# EAGLE design untitled (EAGLE 6.1)
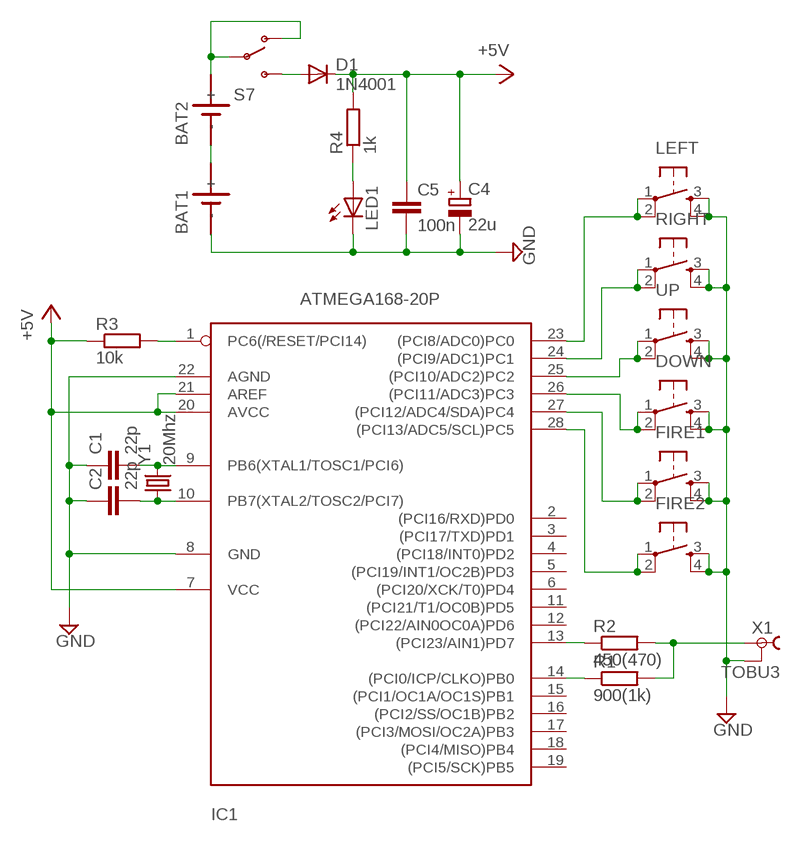
[diagram p0: schematic, sheet 1]

## Parts
BAT1  SN2032  [SN2032]
BAT2  SN2032  [SN2032]
C1  22p  C-EU025-025X050  [C025-025X050]
C2  22p  C-EU025-025X050  [C025-025X050]
C4  22u  CPOL-EUTT2D5L  [TT2D5L]
C5  100n  C-EU025-025X050  [C025-025X050]
D1  1N4001  DIODE-D-2.5  [D-2.5]
DOWN  TAC_SWITCHPTH  [TACTILE-PTH]
FIRE1  TAC_SWITCHPTH  [TACTILE-PTH]
FIRE2  TAC_SWITCHPTH  [TACTILE-PTH]
IC1  ATMEGA168-20P  [DIL28-3]
LED1  LED3MM  [LED3MM]
LEFT  TAC_SWITCHPTH  [TACTILE-PTH]
R1  900(1k)  R-EU_0207/2V  [0207/2V]
R2  450(470)  R-EU_0207/2V  [0207/2V]
R3  10k  R-EU_0207/10  [0207/10]
R4  1k  R-EU_0204/2V  [0204V]
RIGHT  TAC_SWITCHPTH  [TACTILE-PTH]
S7  SWITCH-SPSTPTH  [SWITCH-SPDT]
UP  TAC_SWITCHPTH  [TACTILE-PTH]
X1  TOBU3  [TOBU3]
Y1  20Mhz  CRYSTALHC49US  [HC49US]

## Nets
+5V: C4.+ C5.1 D1.C IC1.7(VCC) IC1.20(AVCC) IC1.21(AREF) R3.1 R4.2
GND: BAT1.- C1.1 C2.1 C4.- C5.2 DOWN.3 DOWN.4 FIRE1.3 FIRE1.4 FIRE2.3 FIRE2.4 IC1.8(GND) IC1.22(AGND) LED1.K(C) LEFT.3 LEFT.4 RIGHT.3 RIGHT.4 UP.3 UP.4 X1.2 X1.2@1 X1.2@2
N$1: C1.2 IC1.9(PB6(XTAL1/TOSC1/PCI6)) Y1.2
N$2: C2.2 IC1.10(PB7(XTAL2/TOSC2/PCI7)) Y1.1
N$3: BAT2.+ S7.1(O) S7.2(P)
N$4: IC1.23((PCI8/ADC0)PC0) LEFT.1 LEFT.2
N$5: LED1.A R4.1
N$6: IC1.25((PCI10/ADC2)PC2) UP.1 UP.2
N$7: IC1.1(PC6(/RESET/PCI14)) R3.2
N$8: FIRE2.1 FIRE2.2 IC1.28((PCI13/ADC5/SCL)PC5)
N$9: FIRE1.1 FIRE1.2 IC1.27((PCI12/ADC4/SDA)PC4)
N$10: DOWN.1 DOWN.2 IC1.26((PCI11/ADC3)PC3)
N$11: D1.A S7.3(S)
N$12: BAT1.+ BAT2.-
N$15: IC1.14((PCI0/ICP/CLKO)PB0) R1.1
N$16: IC1.13((PCI23/AIN1)PD7) R2.1
N$17: R1.2 R2.2 X1.1
RIGHT: IC1.24((PCI9/ADC1)PC1) RIGHT.1 RIGHT.2
Unconnected: IC1.2((PCI16/RXD)PD0) IC1.3((PCI17/TXD)PD1) IC1.4((PCI18/INT0)PD2) IC1.5((PCI19/INT1/OC2B)PD3) IC1.6((PCI20/XCK/T0)PD4) IC1.11((PCI21/T1/OC0B)PD5) IC1.12((PCI22/AIN0OC0A)PD6) IC1.15((PCI1/OC1A/OC1S)PB1) IC1.16((PCI2/SS/OC1B)PB2) IC1.17((PCI3/MOSI/OC2A)PB3) IC1.18((PCI4/MISO)PB4) IC1.19((PCI5/SCK)PB5)

## Library data of the parts
BAT1 BAT2 = sn2032:SN2032: LI BATTERY
C1 C2 C5 = rcl:C-EU: CAPACITOR, European symbol
C4 = rcl:CPOL-EU: POLARIZED CAPACITOR, European symbol
D1 = diode:DIODE-: DIODE
DOWN FIRE1 FIRE2 LEFT RIGHT UP = SparkFun-Electromechanical:TAC_SWITCH: Momentary Switch Button commonly used for reset or general input. Spark Fun Electronics SKU : COM-00097 SMT- SWCH-08247
IC1 = adafruit:ATMEGA168*P: MICROCONTROLLER 16 kBytes FLASH 1 kBytes SRAM 512 Bytes EEPROM USART 8-channel 10 bit ADC
LED1 = led:LED: LED OSRAM: - CHIPLED LG R971, LG N971, LY N971, LG Q971, LY Q971, LO R971, LY R971 LH N974, LH R974 LS Q976, LO Q976, LY Q976 LO Q996 - Hyper CHIPLED LW Q18S LB Q993, LB Q99A, LB R99A - SideLED LS A670, LO A670, LY A670, LG A670, LP A670 LB A673, LV A673, LT A673, LW A673 LH A674 LY A675 LS A676, LA A676, LO A676, LY A676, LW A676 LS A679, LY A679, LG A679 - Hyper Micro SIDELED® LS Y876, LA Y876, LO Y876, LY Y876 LT Y87S - SmartLED LW L88C, LW L88S LB L89C, LB L89S, LG L890 LS L89K, LO L89K, LY L89K LS L896, LA L896, LO L896, LY L896 - TOPLED LS T670, LO T670, LY T670, LG T670, LP T670 LSG T670, LSP T670, LSY T670, LOP T670, LYG T670 LG T671, LOG T671, LSG T671 LB T673, LV T673, LT T673, LW T673 LH T674 LS T676, LA T676, LO T676, LY T676, LB T676, LH T676, LSB T676, LW T676 LB T67C, LV T67C, LT T67C, LS T67K, LO T67K, LY T67K, LW E67C LS E67B, LA E67B, LO E67B, LY E67B, LB E67C, LV E67C, LT E67C LW T67C LS T679, LY T679, LG T679 LS T770, LO T770, LY T770, LG T770, LP T770 LB T773, LV T773, LT T773, LW T773 LH T774 LS E675, LA E675, LY E675, LS T675 LS T776, LA T776, LO T776, LY T776, LB T776 LHGB T686 LT T68C, LB T68C - Hyper Mini TOPLED® LB M676 - Mini TOPLED Santana® LG M470 LS M47K, LO M47K, LY M47K Source: http://www.osram.convergy.de LUXEON: - LUMILED® LXK2-PW12-R00, LXK2-PW12-S00, LXK2-PW14-U00, LXK2-PW14-V00 LXK2-PM12-R00, LXK2-PM12-S00, LXK2-PM14-U00 LXK2-PE12-Q00, LXK2-PE12-R00, LXK2-PE12-S00, LXK2-PE14-T00, LXK2-PE14-U00 LXK2-PB12-K00, LXK2-PB12-L00, LXK2-PB12-M00, LXK2-PB14-N00, LXK2-PB14-P00, LXK2-PB14-Q00 LXK2-PR12-L00, LXK2-PR12-M00, LXK2-PR14-Q00, LXK2-PR14-R00 LXK2-PD12-Q00, LXK2-PD12-R00, LXK2-PD12-S00 LXK2-PH12-R00, LXK2-PH12-S00 LXK2-PL12-P00, LXK2-PL12-Q00, LXK2-PL12-R00 Source: www.luxeon.com KINGBRIGHT: KA-3528ASYC Source: www.kingbright.com
R1-R4 = rcl:R-EU_: RESISTOR, European symbol
S7 = SparkFun:SWITCH-SPST: SPST Switch Simple slide switch. Spark Fun Electronics SKU : COM-00102
X1 = con-hirschmann:TOBU3: Female Cinch CONNECTOR ( RCA Jack ); MF: FARNELL; MPN: TOBU 3; OC_FARNELL: 592791; OC_NEWARK: 06WX5914
Y1 = SparkFun-FreqCtrl:CRYSTAL: Various standard crystals. Proven footprints. Spark Fun Electronics SKU : COM-00534

## Board
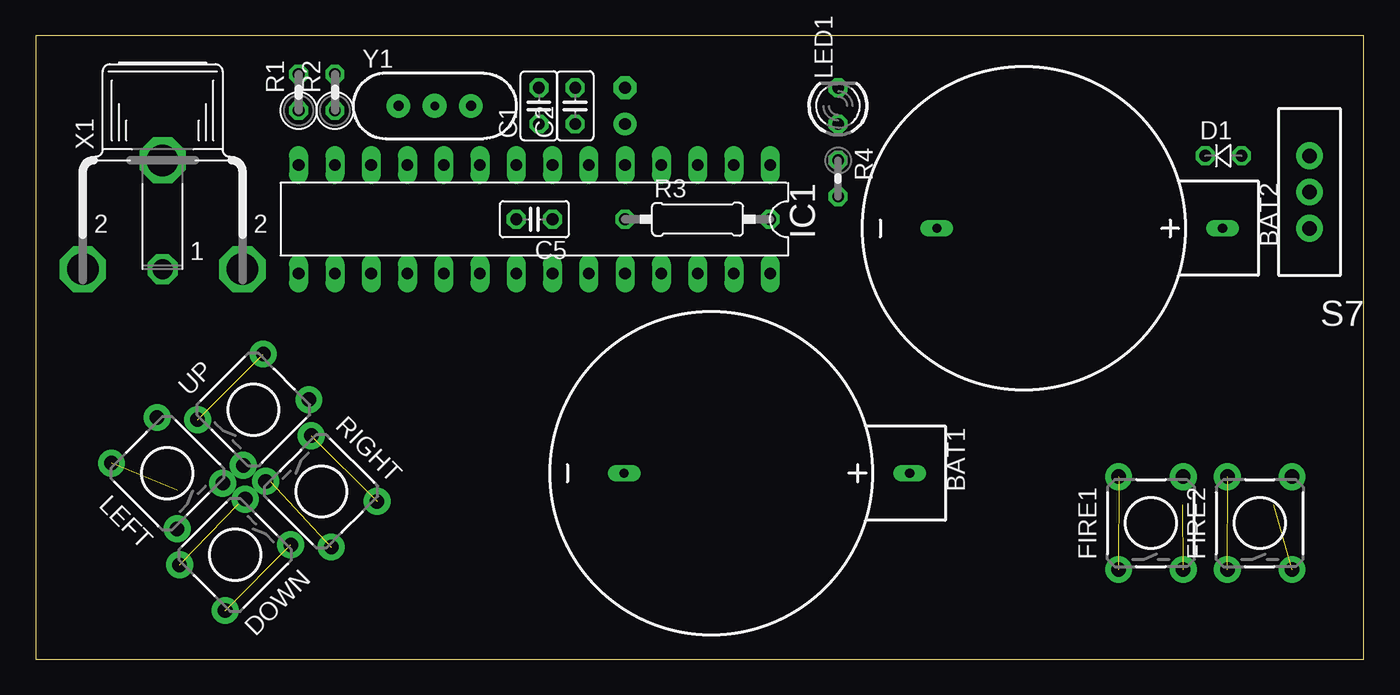
[diagram p1: board, top side]
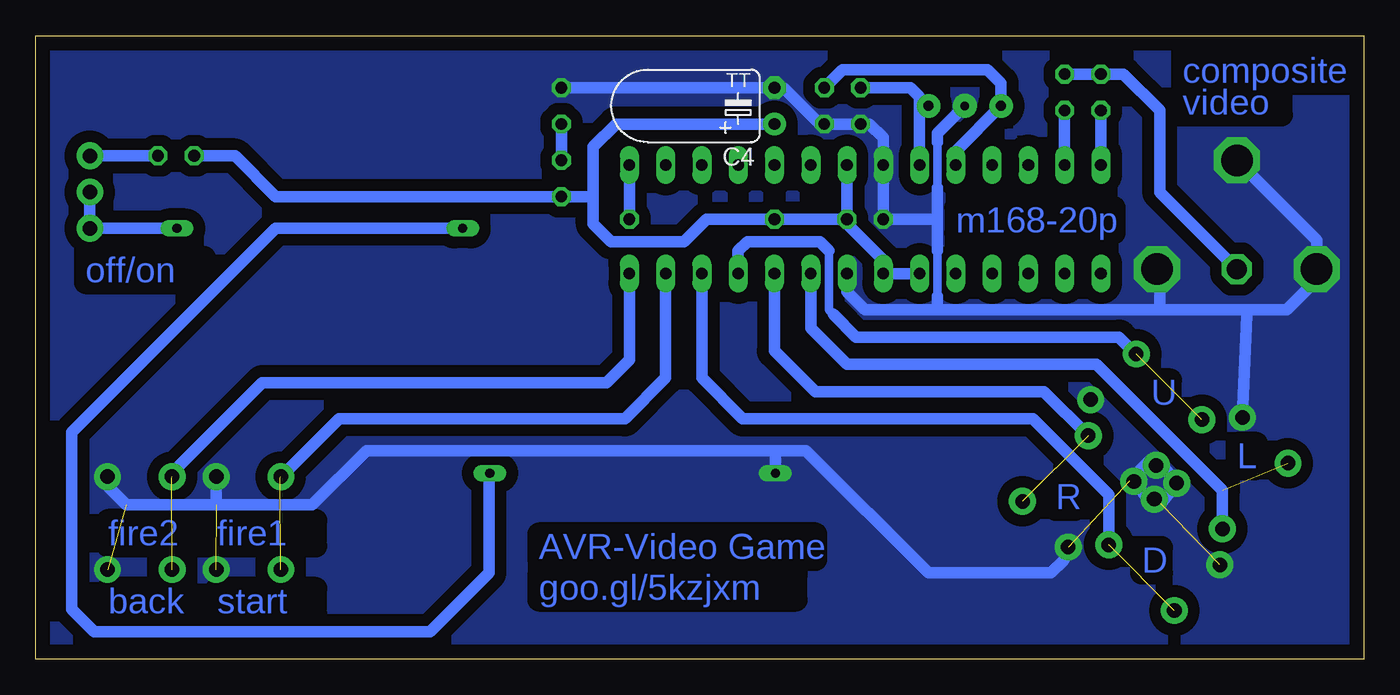
[diagram p2: board, bottom side, seen from below]

Size 93.02 x 43.65 mm. Coordinates in mm from the lower left corner, seen from the top.
Outline: 0,0 93.02,0 93.02,43.65 0,43.65 0,0
Copper layers (1*16): Top 0.035mm / dielectric 1.5mm / Bottom 0.035mm
Design rules: minimum track width 10mil, minimum drill 24mil, track to track 8mil, track to pad 8mil, pad to pad 8mil, via to via 8mil, smd to smd 8mil, copper to edge 40mil, drill to drill 8mil, minimum pad ring 10mil, minimum via ring 8mil, stop-mask expansion 4mil, vias tented up to drill 0mil, thermal gap 10mil

### Footprints (pad centres in the part's own frame; a part is rotated, then mirrored left to right if it is on the bottom)
SN2032 = drill 0.65 long: + 0,13.9; - 0,-6.1
C025-025X050 = drill 0.813 octagon: 1 -1.27,0; 2 1.27,0
TT2D5L = drill 0.813 pad 1.6: + -1.27,0 | drill 0.813 pad 1.6 octagon: - 1.27,0
D-2.5 = drill 0.813 octagon: A 1.27,0; C -1.27,0
TACTILE-PTH = drill 1.016 pad 1.88: 1 -3.251,2.261; 2 3.251,2.261; 3 -3.251,-2.261; 4 3.251,-2.261
DIL28-3 = drill 0.813 long: 1 -16.51,-3.81; 2 -13.97,-3.81; 3 -11.43,-3.81; 4 -8.89,-3.81; 5 -6.35,-3.81; 6 -3.81,-3.81; 7 -1.27,-3.81; 8 1.27,-3.81; 9 3.81,-3.81; 10 6.35,-3.81; 11 8.89,-3.81; 12 11.43,-3.81; 13 13.97,-3.81; 14 16.51,-3.81; 15 16.51,3.81; 16 13.97,3.81; 17 11.43,3.81; 18 8.89,3.81; 19 6.35,3.81; 20 3.81,3.81; 21 1.27,3.81; 22 -1.27,3.81; 23 -3.81,3.81; 24 -6.35,3.81; 25 -8.89,3.81; 26 -11.43,3.81; 27 -13.97,3.81; 28 -16.51,3.81
LED3MM = drill 0.813 octagon: A -1.27,0; K 1.27,0
0207/2V = drill 0.813 octagon: 1 -1.27,0; 2 1.27,0
0207/10 = drill 0.813 octagon: 1 -5.08,0; 2 5.08,0
0204V = drill 0.813 octagon: 1 -1.27,0; 2 1.27,0
SWITCH-SPDT = drill 1.016 pad 1.88: 1 0,2.54; 2 0,0; 3 0,-2.54
TOBU3 = drill 1.397 octagon: 1 0,-2.54 | drill 2.21 octagon: 2 5.588,-2.54; 2@1 -5.588,-2.54; 2@2 0,5.08
HC49US = drill 0.7 pad 1.651: 1 -2.54,0; 2 2.54,0

### Placement (x,y rotation side)
BAT1  47.31,13.02 270 top
BAT2  69.22,30.16 270 top
C1  35.24,38.73 90 top
C2  37.78,38.73 90 top
C4  41.27,38.73 90 bottom
C5  34.92,30.8 180 top
D1  83.19,35.24 0 top
DOWN  13.97,7.3 225 top
FIRE1  78.11,9.53 90 top
FIRE2  85.72,9.53 90 top
IC1  34.92,30.8 180 top
LED1  56.2,38.73 90 top
LEFT  9.21,13.02 135 top
R1  18.41,39.69 90 top
R2  20.95,39.69 90 top
R3  46.35,30.8 0 top
R4  56.2,33.66 270 top
RIGHT  20,11.75 315 top
S7  89.22,32.7 180 top
UP  15.24,17.46 45 top
X1  8.89,29.84 0 top
Y1  27.94,38.73 0 top

### Tracks (layer width: path | path; a pad name or v marks a point on that pad's centre or on a via)
+5V
  Bottom 0.813: C4.+ 52.39,37.47 53.98,35.88 53.98,32.38 | D1.C 79.06,35.24 76.2,32.38 R4.2 53.98,32.38 | 53.98,32.38 53.98,30.48 52.7,29.21 47.62,29.21 46.04,30.8 R3.1 C5.1 | IC1.7 C5.1 | IC1.20 IC1.21 33.66,27.94 36.2,30.48 C5.1
GND  (via drill 0.6 pad 1.68)  (4 unrouted)
  Bottom 0.61: 29.84,25.4 29.84,28.57 | 29.84,33.02 29.84,36.2
  Bottom 0.813: v27.94,38.73 29.84,36.83 29.84,36.2 | IC1.22 36.2,25.72 34.92,24.45 29.84,24.45 | X1.2@1 3.3,29.34 X1.2@2 | 3.17,27.3 3.17,26.67 5.4,24.45 8.26,24.45 | 29.84,24.45 14.29,24.45 | 8.26,24.45 14.29,24.45 | X1.2 14.29,27.11 14.29,24.45 | LEFT.4 8.19,24.07 8.26,24.45 | 41.21,14.61 69.85,14.61 73.66,10.79 80.33,10.79 | 80.33,10.79 86.68,10.79 87.95,12.06 87.95,12.7 | FIRE1.4 80.37,10.83 80.33,10.79 | LED1.K C4.- 40.64,40.01 38.1,37.47 C2.1 C1.1 34.61,37.47 33.66,36.51 IC1.8 C5.2 29.84,30.8 | BAT1.- 41.21,14.61 | RIGHT.4 21.02,6.92 21.91,6.03 30.48,6.03 39.05,14.61 41.21,14.61 | 29.84,24.45 29.84,25.4 | 29.84,28.57 29.84,30.8 | 29.84,30.8 29.84,33.02 | UP.3 14.35,13.88 LEFT.3 14.22,10.88 DOWN.3 14.86,10.88 RIGHT.3 16.42,12.47 15.01,13.88 UP.3
  pour Bottom (isolate 0.813, no thermals): 0,0 93.03,0.32 93.03,43.81 0,43.81
N$1
  Bottom 0.813: IC1.9 31.11,38.73 | 31.11,38.73 31.11,39.37 31.75,40.01 C1.2 | Y1.2 31.11,38.73
N$2
  Bottom 0.813: IC1.10 28.57,35.56 Y1.1 25.4,40.32 26.35,41.27 36.51,41.27 C2.2
N$3
  Bottom 0.813: BAT2.+ S7.1 S7.2
N$4  (1 unrouted)
  Bottom 0.813: IC1.23 38.73,23.18 36.2,20.64 18.73,20.64 9.91,11.81 LEFT.1
N$5
  Bottom 0.813: R4.1 LED1.A
N$6  (1 unrouted)
  Bottom 0.61: 37.47,28.57 37.47,24.45 37.15,24.13
  Bottom 0.813: 37.47,28.57 38.1,29.21 43.18,29.21 43.81,28.57 IC1.25 | UP.2 16.28,21.68 17.14,22.54 35.56,22.54 37.15,24.13
N$7
  Bottom 0.813: R3.2 IC1.1
N$8  (2 unrouted)
  Bottom 0.813: IC1.28 51.44,20.95 53.02,19.37 77.15,19.37 83.5,13.02 83.5,12.7
N$9  (2 unrouted)
  Bottom 0.813: IC1.27 48.9,19.68 51.75,16.83 71.75,16.83 75.88,12.7
N$10  (1 unrouted)
  Bottom 0.813: IC1.26 46.35,19.68 43.5,16.83 23.18,16.83 17.87,11.52 DOWN.1
N$11
  Bottom 0.813: S7.3 D1.A
N$12
  Bottom 0.813: BAT2.- 76.2,30.16 90.49,15.88 90.49,3.49 88.9,1.91 65.41,1.91 61.28,6.03 61.28,13.02 BAT1.+
N$15
  Bottom 0.813: R1.1 IC1.14
N$16
  Bottom 0.813: R2.1 IC1.13
N$17
  Bottom 0.813: R2.2 R1.2 16.83,40.96 14.29,38.42 14.29,32.7 X1.1
RIGHT  (1 unrouted)
  Bottom 0.813: IC1.24 41.27,21.59 38.42,18.73 22.39,18.73 RIGHT.1

### Text on the board
Bottom: composite | video | m168-20p | off/on | U | L | R | fire1 | fire2 | AVR-Video Game | D | goo.gl/5kzjxm | start | back